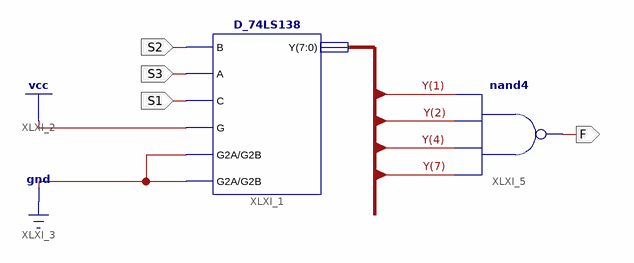
[diagram p0: schematic sheet 1]
// Xilinx ISE schematic LampCtrl_138.sch (kintex7) as structural Verilog: 2 symbols, 4 ports
module LampCtrl_138 (
  input  S2,
  input  S3,
  input  S1,
  output F
);

  wire [7:0] Y;

  D_74LS138 XLXI_1 (.B(S2), .A(S3), .C(S1), .G(1'b1), .G2A(1'b0), .G2B(1'b0), .Y(Y));
  nand XLXI_5 (F, Y[7], Y[4], Y[2], Y[1]);
endmodule
